# Altium schematic sheet InterfaceGSM.SchDoc: CONTROLADORA AIRPOPCORN
size A3; DocumentNumber: 10.00.0025; SheetNumber: 10; SheetTotal: 16
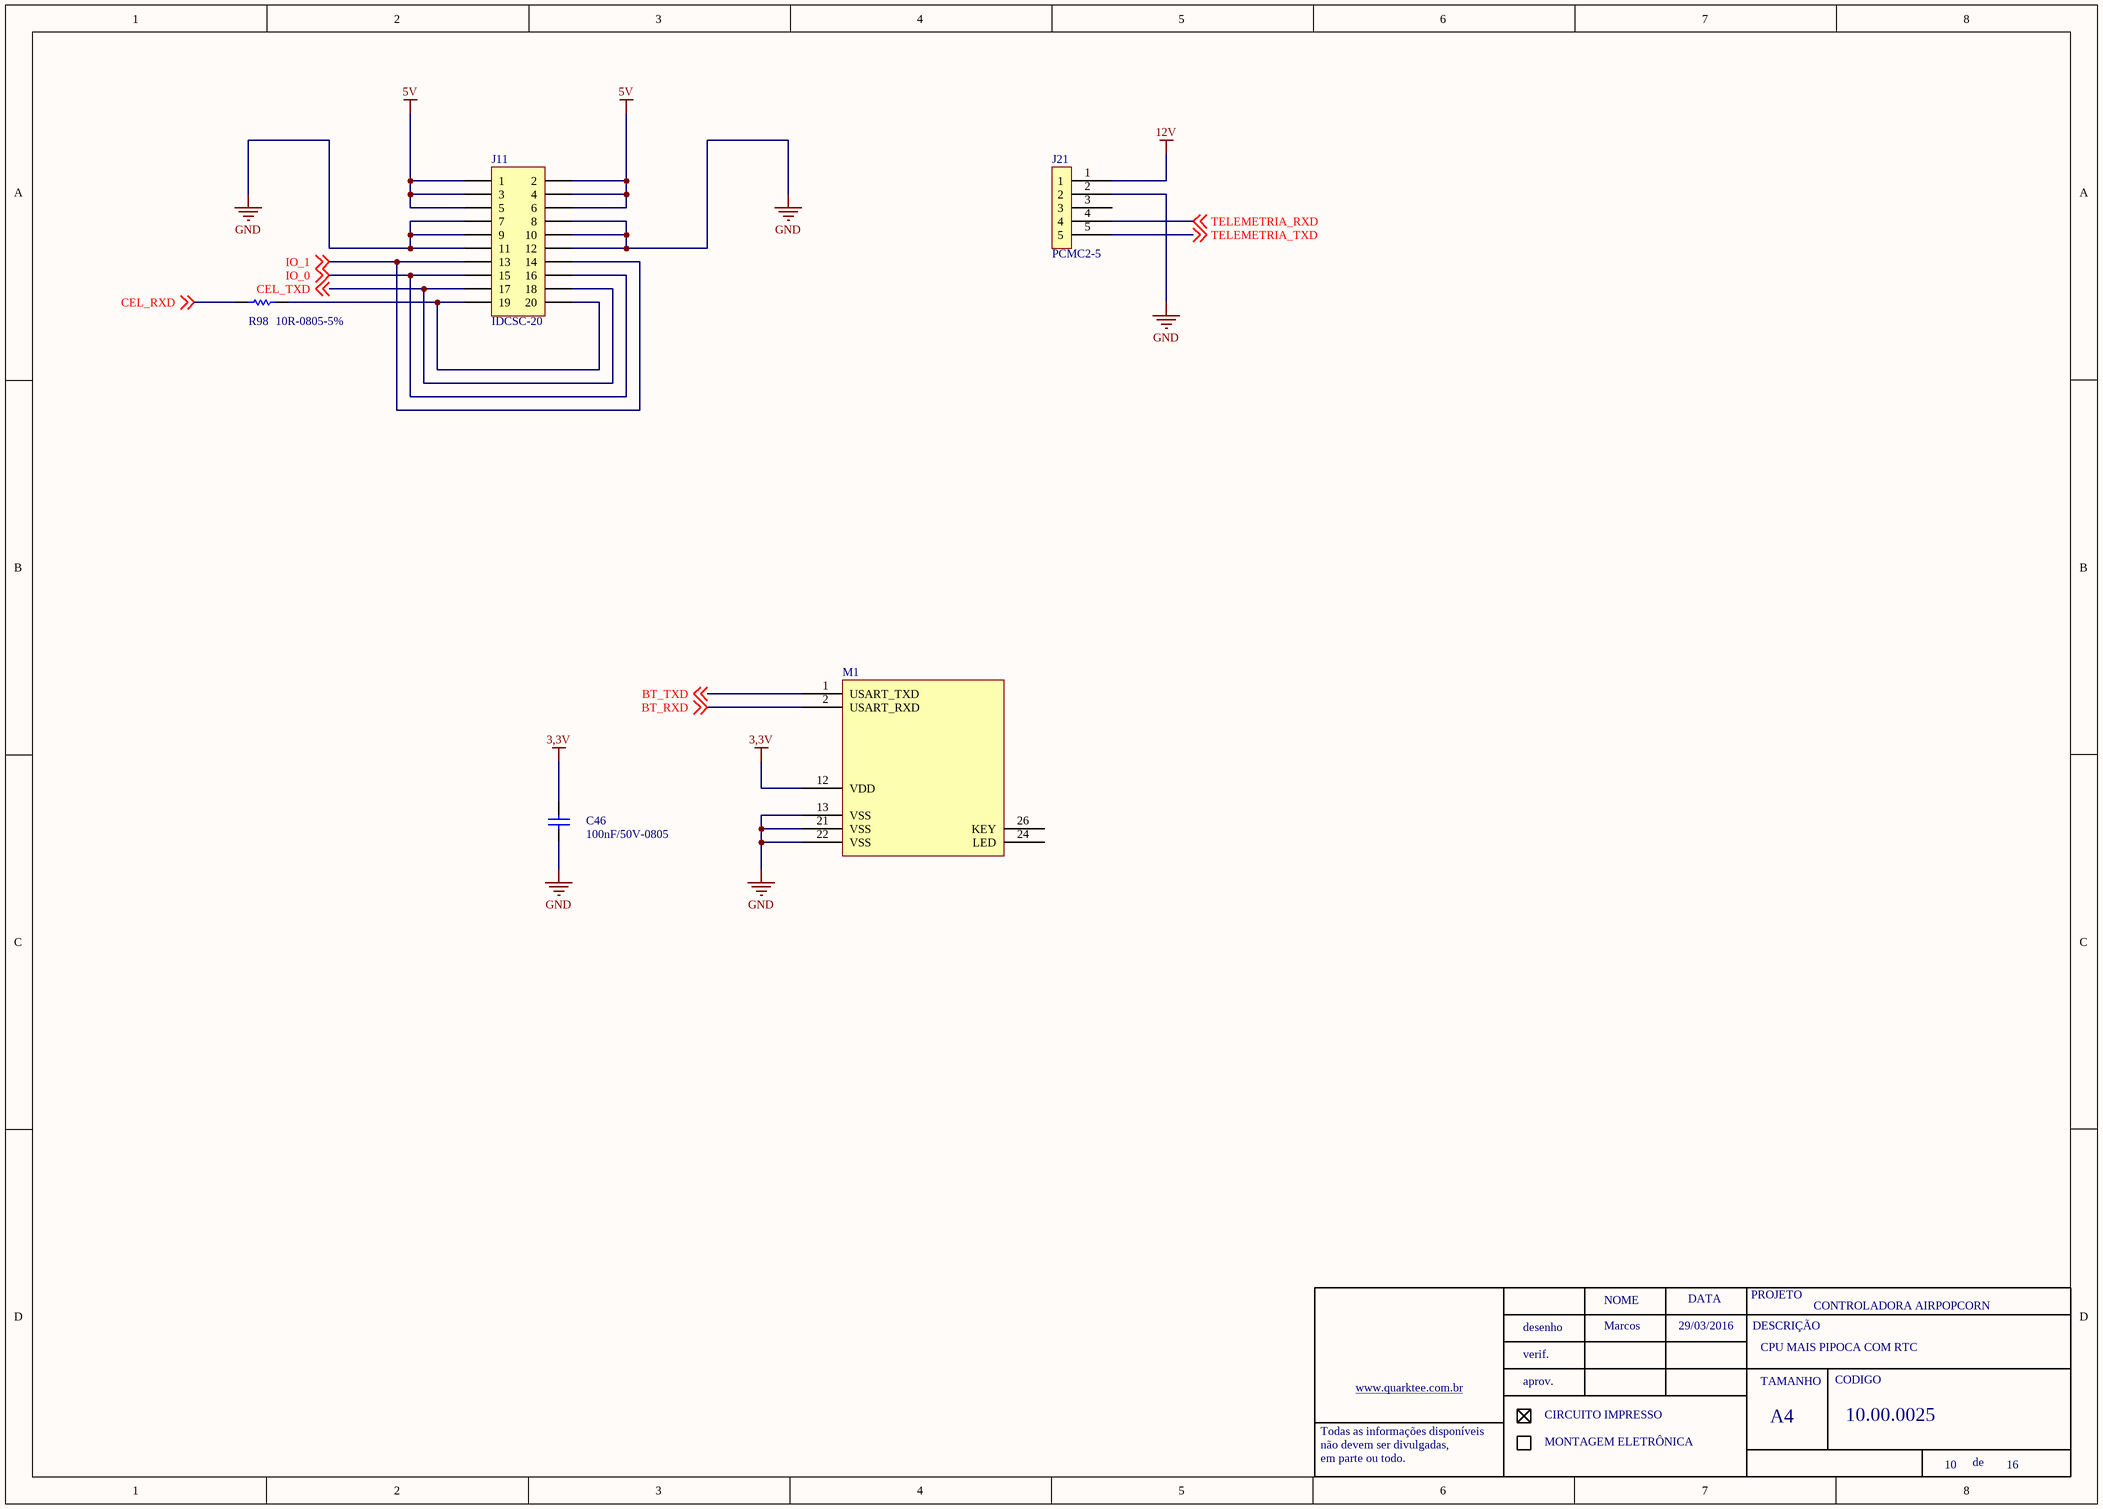
[diagram p0: InterfaceGSM.SchDoc]

## Parts
C46  100nF/50V-0805  [0805-REVISADO O]
J11  IDCSC-20  [IDCSC-20]
J21  PCMC2-5  [PCMC2-5]
M1  (no value)
R98  10R-0805-5%  [0805-REVISADO O]

## Nets
3,3V: C46.2 M1.12(VDD)
5V: J11.1 J11.2 J11.3 J11.4 J11.5 J11.6
12V: J21.1
GND: C46.1 J11.7 J11.8 J11.9 J11.10 J11.11 J11.12 J21.2 M1.13(VSS) M1.21(VSS) M1.22(VSS)
BT_RXD: M1.2(USART_RXD) ; off-sheet BT_RXD
BT_TXD: M1.1(USART_TXD) ; off-sheet BT_TXD
CEL_RXD: R98.1 ; off-sheet CEL_RXD
CEL_TXD: J11.17 J11.18 ; off-sheet CEL_TXD
IO_0: J11.15 J11.16 ; off-sheet IO_0
IO_1: J11.13 J11.14 ; off-sheet IO_1
TELEMETRIA_RXD: J21.4 ; off-sheet TELEMETRIA_RXD
TELEMETRIA_TXD: J21.5 ; off-sheet TELEMETRIA_TXD
NetJ11_19: J11.19 J11.20 R98.2

Not connected (* = marked no-connect by the designer): J21 3; M1 24(LED) 26(KEY)

## Notes on the sheet
- Marcos
- 29/03/2016
- CPU MAIS PIPOCA COM RTC
- NOME
- DATA
- PROJETO
- DESCRIÇÃO
- www.quarktee.com.br
- desenho
- verif.
- aprov.
- TAMANHO
- CODIGO
- Todas as informações disponíveis
- não devem ser divulgadas,
- em parte ou todo.
- CIRCUITO IMPRESSO
- MONTAGEM ELETRÔNICA
- A4
- de

## Library data of the parts
C46 = 100nF/50-0805-NPO: ERP: 104.11.005
J11 = IDC 10x2: ERP: 435.00.013
M1 = HC-06 BLUETOOTH: HC-06
R98 = 10R-0805-5%: ERP: 102.11.019